# Altium schematic sheet Boost voltage module sheet.SchDoc
size A4
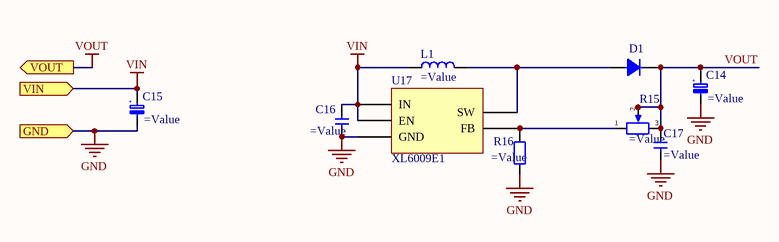
[diagram p0: Boost voltage module sheet.SchDoc]

## Parts
C14  (no value)  [D8C3.2H12]
C15  (no value)  [D8C3.2H12]
C16  (no value)  [cap0603]
C17  (no value)  [cap0603]
D1  Diode SMD  [SOD123]  (value not drawn)
L1  (no value)  [SRR1280]
R15  (no value)  [3224W]
R16  (no value)  [res0603]
U17  XL6009E1  [TO263-5L]

## Ports
GND (in), VIN (in), VOUT (out)

## Nets
GND: C14.2(MINUS) C15.2(MINUS) C16.2 C17.2 R16.1 U17.1(GND) ; port GND
VIN: C15.1(PLUS) C16.1 L1.1 U17.2(EN) U17.4(IN) ; port VIN
VOUT: C14.1(PLUS) C17.1 D1.2 R15.2 R15.3 ; port VOUT
NetD1_1: D1.1 L1.2 U17.3(SW)
NetR15_1: R15.1 R16.2 U17.5(FB)

## Notes on the sheet
- (in symbol Cap Aluminum) +

## Library data of the parts
C14 C15 = Cap Aluminum
C16 C17 = Cap SMD
L1 = Inductor
R15 = Potentiometer
R16 = Resistor SMD